# Altium schematic sheet Eload Power Module - Gen 2 Rev 3.SchDoc
size C
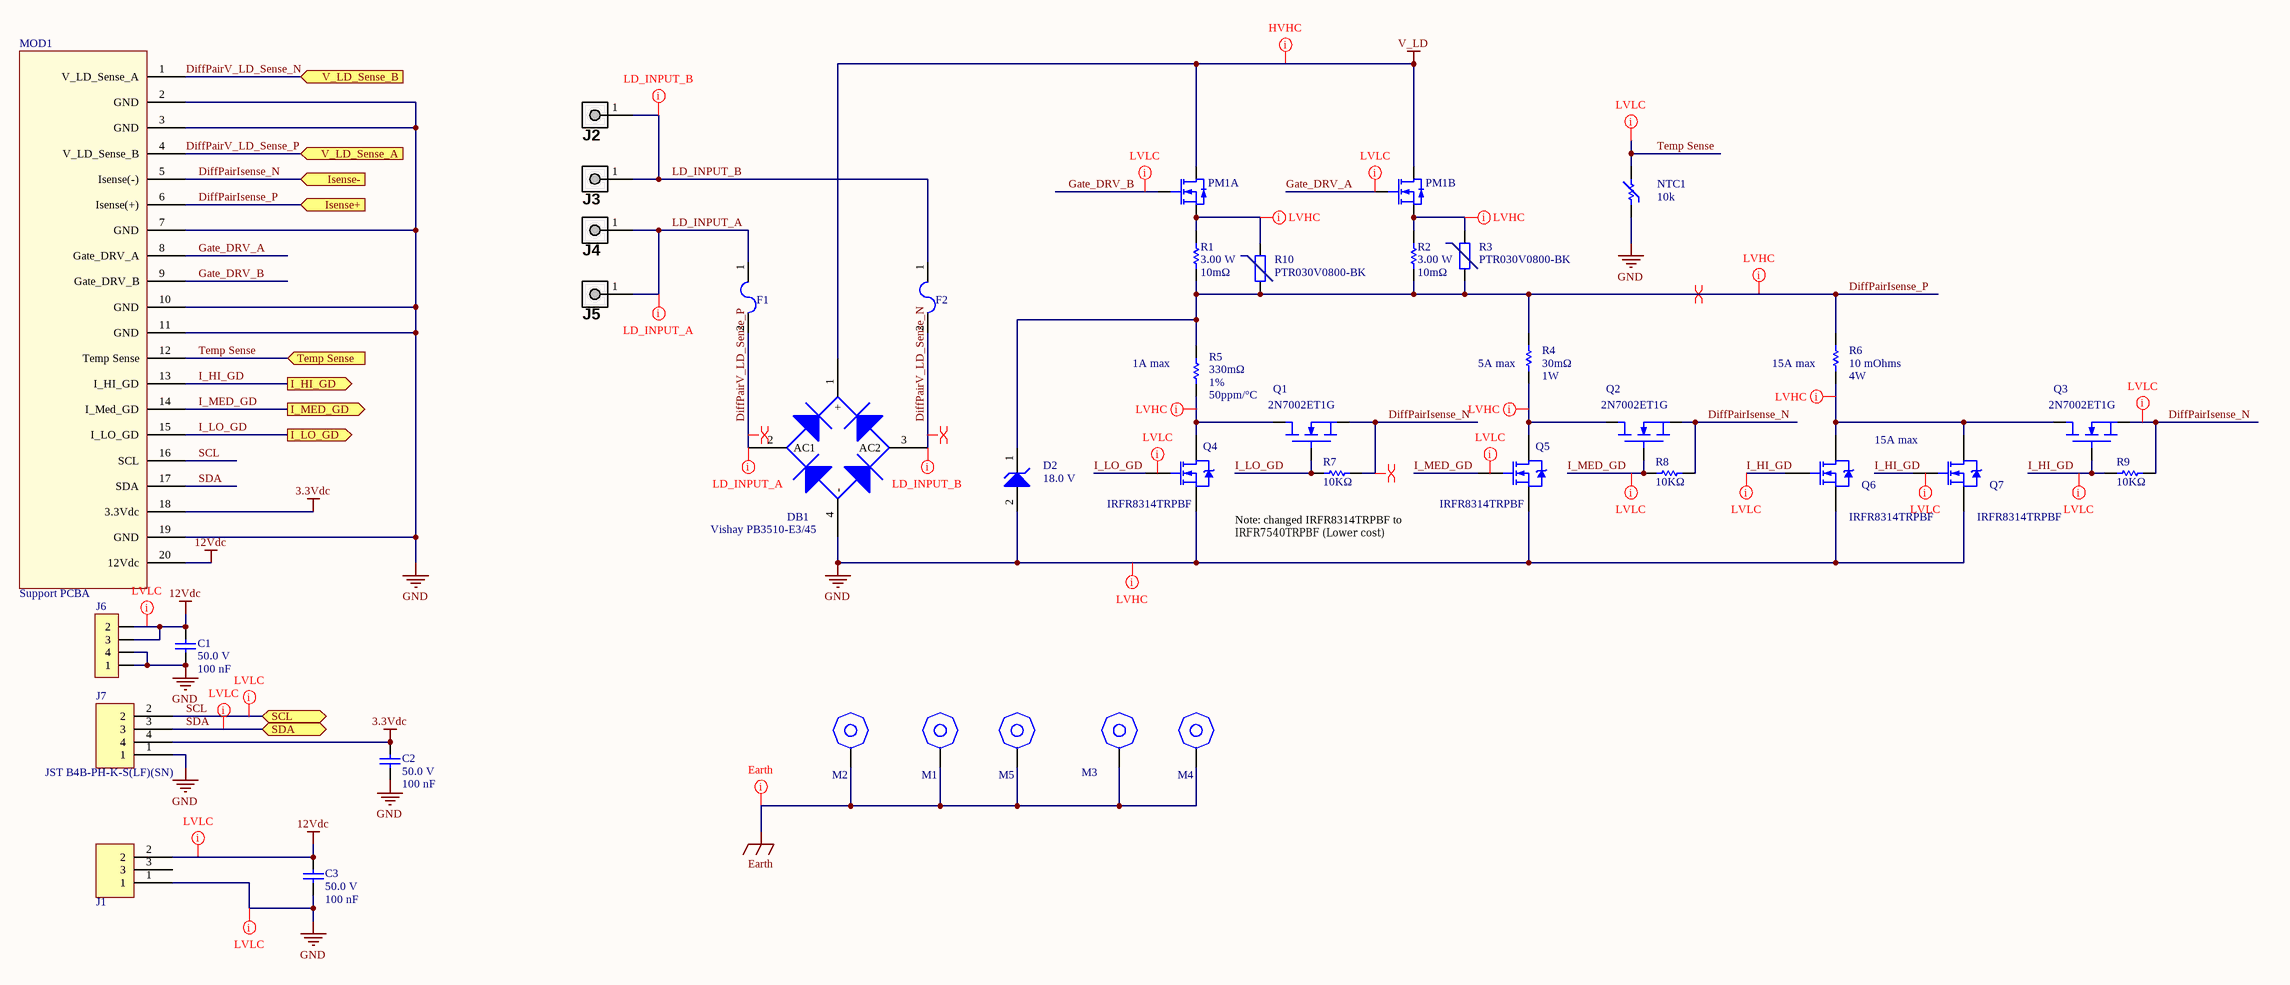
[diagram p0: Eload Power Module - Gen 2 Rev 3.SchDoc]

## Parts
C1  Voltage Rating (DC): 50.0 V  Capacitance: 100 nF  [Cap,0805]  (hidden comment: Cap)
C2  Voltage Rating (DC): 50.0 V  Capacitance: 100 nF  [Cap,0805]  (hidden comment: Cap)
C3  Voltage Rating (DC): 50.0 V  Capacitance: 100 nF  [Cap,0805]  (hidden comment: Cap)
D2  Voltage Rating (DC): 18.0 V  [SOD123]  (hidden comment: MMSZ4705T1G)
DB1  Vishay PB3510-E3/45  [4-ESIP with Heat Sink]
F1  FUSE CERAMIC 30A 500VAC/VDC 3AB  [Fuse,TH,Vertical,0505030.MXEP]  (value not drawn)
F2  FUSE CERAMIC 30A 500VAC/VDC 3AB  [Fuse,TH,Vertical,0505030.MXEP]  (value not drawn)
J1  2-644861-3  [Connector,TE,3-Pin,Male,Vert,2-644861-3]  (value not drawn)
J2  wire teminal, lugs, screw, Keystone 8197  [Keystone 8197]  (value not drawn)
J3  wire teminal, lugs, screw, Keystone 8197  [Keystone 8197]  (value not drawn)
J4  wire teminal, lugs, screw, Keystone 8197  [Keystone 8197]  (value not drawn)
J5  wire teminal, lugs, screw, Keystone 8197  [Keystone 8197]  (value not drawn)
J6  0022112042  [conn, molex, 0.1", 4 pin]  (value not drawn)
J7  JST B4B-PH-K-S(LF)(SN)  [Conn, JST, 4 pin, 2mm spacing Right Angle]
M1  M3 hex Standoff  [Standoff,Hex,M3,8mm]  (value not drawn)
M2  M3 hex Standoff  [Standoff,Hex,M3,8mm]  (value not drawn)
M3  M3 hex Standoff  [Standoff,Hex,M3,8mm]  (value not drawn)
M4  M3 hex Standoff  [Standoff,Hex,M3,8mm]  (value not drawn)
M5  M3 hex Standoff  [Standoff,Hex,M3,8mm]  (value not drawn)
MOD1  Support PCBA  [Mod,ELoad Gen 2 Rev 1 Support]
NTC1  Resistance in Ohms @ 25°C: 10k  [NTC,TH,2.54mm Lead Spacing,NTCLE100E3103JT2]  (hidden comment: NTCLE100E3103JT2)
PM1  Diode  [DUAL TO-247-RA WITH HEATSINK]  (value not drawn)  (parts A,B of 2)
Q1  2N7002ET1G  [SOT23-3]
Q2  2N7002ET1G  [SOT23-3]
Q3  2N7002ET1G  [SOT23-3]
Q4  Manufacturer Part Number: IRFR8314TRPBF  [DPAK,3-Leads]  (hidden comment: Infineon IRFR8314TRPBF)
Q5  Manufacturer Part Number: IRFR8314TRPBF  [DPAK,3-Leads]  (hidden comment: Infineon IRFR8314TRPBF)
Q6  Manufacturer Part Number: IRFR8314TRPBF  [DPAK,3-Leads]  (hidden comment: Infineon IRFR8314TRPBF)
Q7  Manufacturer Part Number: IRFR8314TRPBF  [DPAK,3-Leads]  (hidden comment: Infineon IRFR8314TRPBF)
R1  Power Rating: 3.00 W  Resistance: 10mΩ  [Res 2512]  (hidden comment: Res1)
R2  Power Rating: 3.00 W  Resistance: 10mΩ  [Res 2512]  (hidden comment: Res1)
R3  PTR030V0800-BK  [Fuse,PTC,10mmPitch,Radial, Disc]
R4  Power Rating: 1W  Resistance: 30mΩ  [Shunt,2512,SMD,Kalvin conn]  (hidden comment: Ohmite LVM25FVR030E-TR)
R5  Resistance: 330mΩ  Tolerance: 1%  Temperature Coefficient: 50ppm/°C  [Res,1206]  (hidden comment: Res,1206,0.330Ohm,shunt,0.75W,1%,50ppm,KRL1632E-M-R330-F-T5)
R6  Resistance: 10 mOhms  Power (Watts): 4W  [Res,2827,4W]  (hidden comment: CSSH2728FT10L0)
R7  Resistance: 10KΩ  [res, 0805, HD]  (hidden comment: Vishay / Dale CRCW080510K0FKTA)
R8  Resistance: 10KΩ  [res, 0805, HD]  (hidden comment: Vishay / Dale CRCW080510K0FKTA)
R9  Resistance: 10KΩ  [res, 0805, HD]  (hidden comment: Vishay / Dale CRCW080510K0FKTA)
R10  PTR030V0800-BK  [Fuse,PTC,10mmPitch,Radial, Disc]

## Ports
I_HI_GD (out), I_LO_GD (out), I_MED_GD (out), Isense+ (in), Isense- (in), SCL (bidir), SDA (bidir), Temp Sense (in), V_LD_Sense_A (in), V_LD_Sense_B (in)

## Nets
3.3Vdc: C2.2 J7.4 MOD1.18(3.3Vdc)
12Vdc: C1.2 C3.2 J1.2 J6.2 J6.3 MOD1.20(12Vdc)
Earth: M1.0 M2.0 M3.0 M4.0 M5.0
GND: C1.1 C2.1 C3.1 D2.2(A) DB1.4(-) J1.1 J6.1 J6.4 J7.1 MOD1.2(GND) MOD1.3(GND) MOD1.7(GND) MOD1.10(GND) MOD1.11(GND) MOD1.19(GND) NTC1.1 Q4.2(S) Q5.2(S) Q6.2(S) Q7.2(S)
V_LD: DB1.1(+) PM1.2(D) PM1.5(D)
DiffPairIsense_N: MOD1.5(Isense(-)) Q1.2(S) Q2.2(S) Q3.2(S) R7.2 R8.2 R9.1 ; port Isense-
DiffPairIsense_P: D2.1(K) MOD1.6(Isense(+)) R1.1 R2.1 R3.1 R4.2 R5.1 R6.2 R10.1 ; port Isense+
DiffPairV_LD_Sense_N: DB1.3(AC2) F2.2 MOD1.1(V_LD_Sense_A) ; port V_LD_Sense_B
DiffPairV_LD_Sense_P: DB1.2(AC1) F1.2 MOD1.4(V_LD_Sense_B) ; port V_LD_Sense_A
Gate_DRV_A: MOD1.8(Gate_DRV_A) PM1.4(G)
Gate_DRV_B: MOD1.9(Gate_DRV_B) PM1.1(G)
I_HI_GD: MOD1.13(I_HI_GD) Q3.1(G) Q6.1(G) Q7.1(G) R9.2 ; port I_HI_GD
I_LO_GD: MOD1.15(I_LO_GD) Q1.1(G) Q4.1(G) R7.1 ; port I_LO_GD
I_MED_GD: MOD1.14(I_Med_GD) Q2.1(G) Q5.1(G) R8.1 ; port I_MED_GD
LD_INPUT_A: F1.1 J4.1 J5.1
LD_INPUT_B: F2.1 J2.1 J3.1
SCL: J7.2 MOD1.16(SCL) ; port SCL
SDA: J7.3 MOD1.17(SDA) ; port SDA
Temp Sense: MOD1.12(Temp_Sense) NTC1.2 ; port Temp Sense
NetPM1_3: PM1.3(S) R1.2 R10.2
NetPM1_6: PM1.6(S) R2.2 R3.2
NetQ1_3: Q1.3(D) Q4.3(D) R5.2
NetQ2_3: Q2.3(D) Q5.3(D) R4.1
NetQ3_3: Q3.3(D) Q6.3(D) Q7.3(D) R6.1

Not connected (* = marked no-connect by the designer): J1 3

## Layout directives
net class High Volt; net class High Current: V_LD
net class LD_INPUT_B; net class High Current; net class LDAB Input: DiffPairV_LD_Sense_N, LD_INPUT_B
net class LD_INPUT_A; net class High Current; net class LDAB Input: DiffPairV_LD_Sense_P, LD_INPUT_A
net class Low Volt; net class High Current: DiffPairIsense_P, GND, NetPM1_3, NetPM1_6, NetQ1_3, NetQ2_3, NetQ3_3
net class Low Volt; net class Low Current: 12Vdc, (no net found under the mark), DiffPairIsense_N, Gate_DRV_A, Gate_DRV_B, GND, I_HI_GD, I_MED_GD, SCL, SDA, Temp Sense
net class Low Volt; net class Low Current; net class PwrRail: 12Vdc
differential pair: DiffPairIsense_N, DiffPairIsense_P, DiffPairV_LD_Sense_N, DiffPairV_LD_Sense_P
net class Earth: Earth

## Notes on the sheet
- (near R5) 1A max
- (near R4) 5A max
- (near R6) 15A max
- 15A max
- Note: changed IRFR8314TRPBF to ‎IRFR7540TRPBF (Lower cost)

## Library data of the parts
C1-C3 = Cap,0805,100nf,50V,5%,08055C104JAT2A: Capacitor; Ceramic; Cap 0.1 uF; Tol 5%; Vol-Rtg 50 VDC; SMT; 0805; X7R; Tape & Reel; Lead-Free Status: Lead Free; Case/Package (SI): 2012; Insulation Resistance: 100 GΩ; Detailed Description: 0.1µF ±5% 50V Ceramic Capacitor X7R 0805 (2012 Metric); Mounting Style: Surface Mount; Packaging: Tape & Reel (TR), Cut Tape (CT); RoHS: Compliant; Size-Width: 1.24 mm; Case/Package: 0805; Number of Pins: 2; digikey url: http://www.digikey.ca/product-detail/en/avx-corporation/08055C104JAT2A/478-3352-1-ND/930144; REACH SVHC Compliance: No SVHC; Dielectric Characteristic: X7R; Capacitance Tolerance: ±5%; Size-Length: 2.01 mm; Size-Height: 710 µm; Size-Thickness: 940 µm; Manufacturer Part Number: 08055C104JAT2A; Octopart URL: http://octopart.com/08055c104jat2a-avx-55388010; Operating Temperature: -55°C ~ 125°C
D2 = diode,Zener, 18V,500mW, SOD123,MMSZ4705T1G: Zener Diode 18V 500mW ±5% Surface Mount SOD-123; Manufacturer: ON Semiconductor; Lead-Free Status: Lead Free; Material: Plastic; Power Rating: 0.5 W; Current - Reverse Leakage @ Vr: 50nA @ 13.6V; Voltage - Forward (Vf) (Max) @ If: 900mV @ 10mA; Case/Package: SOD-123; Lifecycle Status: Active; Mounting Style: Surface Mount; Number of Pins: 2; REACH SVHC Compliance: No SVHC; RoHS: Compliant; Operating Temperature: -55°C ~ 150°C; mfg P/N: MMSZ4705T1G
DB1 = diode, bridge, 35A, 1000V,  PB3510-E3/45: RECTIFIER BRIDGE 1000V 35A PB; Lead-Free Status: Lead Free; voltage: 1000; Manufacturer Part Number: PB3510-E3/45; Packaging: Tube; RoHS: Compliant; Mounting Style: Through Hole; Number of Pins: 4; Supplier 1: Newark; Supplier 2: Farnell; Supplier 3: Digi-Key; current: 35A
F1 F2 = Fuse,30A,500VAC/VDC,Leaded: Manufacturer: Littelfuse Inc.; mfg P/N: 0505030.MXEP; Fuse Type: Cartridge, Ceramic; Voltage Rating - AC: 500V; Response Time: Fast; Breaking Capacity @ Rated Voltage: 30kA AC, 20kA DC; Melting I²t: 280; Approvals: CE, cULus; DC Cold Resistance: 0.0038 Ohms; Current Rating: 30A; Voltage Rating - DC: 500V; Package / Case: 3AB, 3AG, 1/4" x 1-1/4" (Axial); Mounting Type: Through Hole; Operating Temperature: -55°C ~ 125°C; Size / Dimension: 0.275" Dia x 1.288" L (6.99mm x 32.72mm)
J1 = Conntector, though hole, TE, 3pin, 2.54mm,2-644861-3: Connector Header Through Hole 3 position 0.100" (2.54mm); Insulation Resistance: 1.00 MΩ; Number of Contacts: 3; Number of Positions Loaded: All; Style: Board to Cable/Wire; Shrouding: Shrouded - 4 Wall; Contact Length - Mating: 0.200" (5.08mm); Contact Length - Post: 0.140" (3.56mm); Overall Contact Length: 0.440" (11.18mm); Material Flammability Rating: UL94 V-0; Current Rating (Amps): Varies by Wire Gauge; Voltage Rating: 250VAC; Number of Positions: 3; Connector Type: Header; Contact Type: Male Pin; Pitch - Mating: 0.100" (2.54mm); Number of Rows: 1; Mounting Type: Through Hole; Termination: Solder; Fastening Type: Friction Lock; Insulation Height: 0.410" (10.41mm); Contact Shape: Square; Contact Finish - Mating: Tin; Contact Finish - Post: Tin; Contact Material: Copper Alloy; Insulation Material: Polyester; Operating Temperature: -55°C ~ 105°C; Applications: General Purpose
J2-J5 = wire teminal, lugs, screw, Keystone 8197: WRIGHT TOOL 8197 Socket, 1 In Dr, 3-1/8 In, 12 Pt, Std. More details: Socket, Drive Size 1 In., Number of Points 12, ...; Manufacturer Part Number: 8197; Current Rating: 30.0 A; Pin Pitch: 0.0020066 m; Lead-Free Status: Lead Free; Number of Contacts: 6; Gender: Male; REACH SVHC Compliance: No SVHC; Orientation: Straight; Contact Material: Brass; Size-Height: 0.011684 m; Contact Plating: Tin; Number of Rows: 2; RoHS: Compliant; Mounting Style: Snap-In, PCB; Termination Style: Screw
J6 = Connector,Through Hole,Molex,2.54mm,4Pin,Vert: Connector Header Through Hole 4 position 0.100" (2.54mm); Manufacturer: Molex; Number of Positions: 4; Number of Positions Loaded: All; Style: Board to Board or Cable; Shrouding: Shrouded - 1 Wall; Contact Length - Mating: 0.295" (7.49mm); Contact Length - Post: 0.140" (3.56mm); Overall Contact Length: 0.560" (14.22mm); Material Flammability Rating: UL94 V-0; p/n: 0022112042; Connector Type: Header; Contact Type: Male Pin; Pitch - Mating: 0.100" (2.54mm); Number of Rows: 1; Mounting Type: Through Hole; Termination: Solder; Fastening Type: Friction Lock; Insulation Height: 0.322" (8.18mm); Contact Shape: Square; Contact Finish - Mating: Gold; Contact Finish Thickness - Mating: 20.0µin (0.51µm); Contact Finish - Post: Tin; Contact Material: Brass; Insulation Material: Polyamide (PA), Nylon; Insulation Color: White; Contact Finish Thickness - Post: 100.0µin (2.54µm); Applications: Automotive, General Purpose, Medical, Telecommunications
J7 = Conntector, though hole, JST, 4pin, 2mm,B4B-PH-K-S(LF)(SN): PH Series 4 Position 2 mm Pitch Through Hole Crimp Top Entry Shrouded Header; Voltage Rating (AC): 100 V; Insulation Resistance: 1.00 MΩ; Number of Contacts: 4; Contact Resistance: 10.0 mΩ; REACH SVHC Compliance: No SVHC; Mounting Style: Through Hole, Vertical; Manufacturer Part Number: B4B-PH-K-S(LF)(SN); Size-Width: 4.50 mm; Number of Positions: 4; Size-Height: 6.00 mm; Size-Length: 9.90 mm; Supplier 1: Farnell; Supplier 2: Newark; Supplier 3: Digi-Key
M1-M5 = Standoff, M3, Hex: HEX STANDOFF M3,generic
MOD1 = Mod,Eload Gen 2 rev 1 Support and Control: Eload Gen 2 Support PCBA
NTC1 = Sensor,Temp,NTC,10Kohm,0.75%, NTCLE100E3103JT2: THERMISTOR NTC 10KOHM 3977K BEAD; Manufacturer: Vishay BC Components; Detailed Description: NTC Thermistor 10k Bead; Categories: Sensors, Transducers   Temperature Sensors - NTC Thermistors; Resistance Tolerance: ±5%; B Value Tolerance: ±0.75%; Power - Max: 500mW; mfg P/N: NTCLE100E3103JT2; Part Status: Active; B25/85: 3977K; Operating Temperature: -40°C ~ 125°C; Length - Lead Wire: 0.59" (15.00mm); Mounting Type: Through Hole; Package / Case: Bead
PM1 = CC Load Power Module: Dual RA Mosfet TO-247 with CPU cooler; Mosfets: IXYS IXTH30N60L2; Cooling assembly: Hyper T2
Q1-Q3 = MOSFET,N-Channel,SOT23,0.25A,60V,2N7002ET1G: Small Signal MOSFET, 60 V, 310 mA, Single, N-Channel, 3-Pin SOT-23, Pb-Free, Tape and Reel; Manufacturer: ON Semiconductor; Continuous Drain Current (Ids): 0.25A; Lead-Free Status: Lead Free; Drain to Source Voltage (Vds): 60.0 V; Power Dissipation (Max): 350mW (Ta); REACH SVHC Compliance: No SVHC; Number of Pins: 3; Halogen Free Status: Halogen Free; Case/Package: SOT-23-3; Polarity: N-Channel; RoHS: Compliant; Lifecycle Status: Active; Manufacturer Part Number: 2N7002ET1G; Supplier 1: Digi-Key; Supplier Part Number 1: 2N7002ET1GOSCT-ND; Supplier 2: LCSC; Supplier Part Number 2: C71533
Q4-Q7 = Mosfet,Dpak, Nchannel,90A,30V, IRFR8314TRPBF: Single N-Channel 30 V 2.2 mOhm 36 nC HEXFET® Power Mosfet - DPAK; Lead-Free Status: Lead Free; Rds On (Max) @ Id, Vgs: 2.2 mOhm @ 90A, 10V; Drain to Source Voltage (Vdss): 30V; Power Dissipation (Max): 125W; Input Capacitance (Ciss) (Max) @ Vds: 4945pF @ 15V; Drive Voltage (Max Rds On, Min Rds On): 4.5V, 10V; Vgs (Max): ±20V; Lifecycle Status: Not Listed by Manufacturer; Operating Temperature: 175 °C (max); Polarity: N-Channel; RoHS: Compliant; Supplier Device Package: D-PAK (TO-252AA); Series: HEXFET®
R1 R2 = Res,2512,10mΩ,3.00W,±1%,CRA2512-FZ-R010ELF: Resistor; Metal Film; Res 0.01 Ohms; Pwr-Rtg 3 W; Tol 1%; SMT; 2512; Current Sense; Case/Package (SI): 2512; Resistance Tolerance: ±1%; Octopart URL: http://octopart.com/cra2512-fz-r010elf-bourns-7483589; Manufacturer Part Number: CRA2512-FZ-R010ELF; Packaging: Tape & Reel (TR), Cut Tape (CT); REACH SVHC Compliance: No SVHC; RoHS: Compliant; Number of Pins: 2; Mounting Style: Surface Mount; Case/Package: 1005
R3 R10 = Fuse,Resettable,8A,30V,ThoughHole,PTR030V0800-BK: PTC RESET FUSE 30V 8A RADIAL; Manufacturer: Eaton - Electronics Division; Detailed Description: Polymeric PTC Resettable Fuse 30V Ih Through Hole Radial, Disc; Approval Agency: cURus, TUV; Current - Max: 100 A; Current - Trip (It): 16 A; Time to Trip: 18.8 s; Resistance - Initial (Ri) (Min): 5 mOhms; Resistance - Post Trip (R1) (Max): 20 mOhms; mfg P/N: PTR030V0800-BK; Supplier 1: Digi-Key; Supplier Part Number 1: PTR030V0800-BK-ND; Supplier 2: Arrow Electronics; Supplier Part Number 2: PTR030V0800-BK1; Supplier 3: Mouser; Supplier Part Number 3: 504-PTR030V0800-BK1; Category: Circuit Protection  PTC Resettable Fuses; Series: PTR030V; Part Status: Active; Type: Polymeric; Voltage - Max: 30V; Operating Temperature: -40°C ~ 85°C; Mounting Type: Through Hole; Package / Case: Radial, Disc; Size / Dimension: 0.850" L x 0.118" W (21.60mm x 3.00mm); Height - Seated (Max): 1.150" (29.20mm); Lead Spacing: 0.394" (10.00mm); Current - Hold (Ih) (Max): 8 A
R4 = Res, 2512, shunt, 30mΩ,1W, LVM25FVR030E-TR: Resistors; Current Sense; SMD 1W 0.030 OHM 1%; Octopart URL: https://octopart.com/lvm25fvr030e-tr-ohmite-74199670; Manufacturer Part Number: LVM25FVR030E-TR; OctopartID: ee9623f0f9863151
R5 = Res,1206,0.330Ohm,shunt,0.75W,1%,50ppm,KRL1632E-M-R330-F-T5: RES 0.33 OHM 1% 3/4W 1206; Manufacturer 1: Susumu; Power Rating: 750mW; Supplier 1: Digi-Key; Manufacturer Part Number 1: KRL1632E-M-R330-F-T5; Stock 1: 23015; Pricing 1: 1=0.54000, 10=0.38500, 25=0.30040, 50=0.25420, 100=0.20020, 250=0.16940, 500=0.13860, 1000=0.10780 (USD); RoHS: Yes; Case/Package: Metal; Weight: 0.000466oz; Case Code (Metric): 1632; Case Code (Imperial): 0612; Min Operating Temperature: -55°C; Max Operating Temperature: 155°C; Packaging: Tape and Reel; Composition: Metal Foil; Termination: SMD/SMT; Length: 3.2mm; Height: 0.5mm; Width: 1.6mm; Lead Free: Lead Free; ComponentLink1URL: http://www.mouser.com/ds/2/392/KRL_New_Short_Data_sheet-1115627.pdf?src-supplier=Mouser; ComponentLink1Description: http://www.mouser.com/ds/2/392/KRL_New_Short_Data_sheet-1115627.pdf?src-supplier=Mouser; ComponentLink2URL: http://www.susumu-usa.com/pdf/Foot_Print_21.pdf?src-supplier=Digi-Key; ComponentLink2Description: http://www.susumu-usa.com/pdf/Foot_Print_21.pdf?src-supplier=Digi-Key; Supplier Part Number 1: 408-1588-1-ND
R6 = Res,2827,shunt,10mΩ,1%,15ppm,CSSH2728FT10L0: 10 mOhms ±1% 4W Chip Resistor Wide 2827 (7067 Metric), 2728 Automotive AEC-Q200, Current Sense Metal Foil; Temperature Coefficient: ±15ppm/°C; Other Names: CSSH 2728 0.01 1% R   CSSH27280.011%RTR   CSSH27280.011%RTR-ND   CSSH27280.01FRTR   CSSH27280.01FRTR-ND   CSSH2728FT10L0TR; mfg P/N: CSSH2728FT10L0; Tolerance: ±1%; Composition: Metal Foil; Features: Automotive AEC-Q200, Current Sense; Operating Temperature: -55°C ~ 225°C; Package / Case: Wide  2827 (7067 Metric), 2728
R7-R9 = Res,0805,10.0kΩ,1%,100 ppm,CRCW080510K0FKTA: RES SMD 10K OHM 1% 1/8W 0805; Temperature Coefficient: 100.0 ppm/C; Lead-Free Status: Contains Lead; Voltage Rating (DC): 150.0 V; Power Rating: 0.125 W; Case/Package (SI): 2012; Size-Width: 0.00125 m; Resistance Tolerance: 1%; Size-Length: 0.002 m; RoHS: Non-Compliant; Power Dissipation: 0.125 W; Number of Pins: 2; REACH SVHC Compliance: No SVHC; Size-Height: 0.00045 m; Case/Package: 0805; Mounting Style: Surface Mount